# EAGLE design Desklamp_H180804_V1 (EAGLE 6.4)
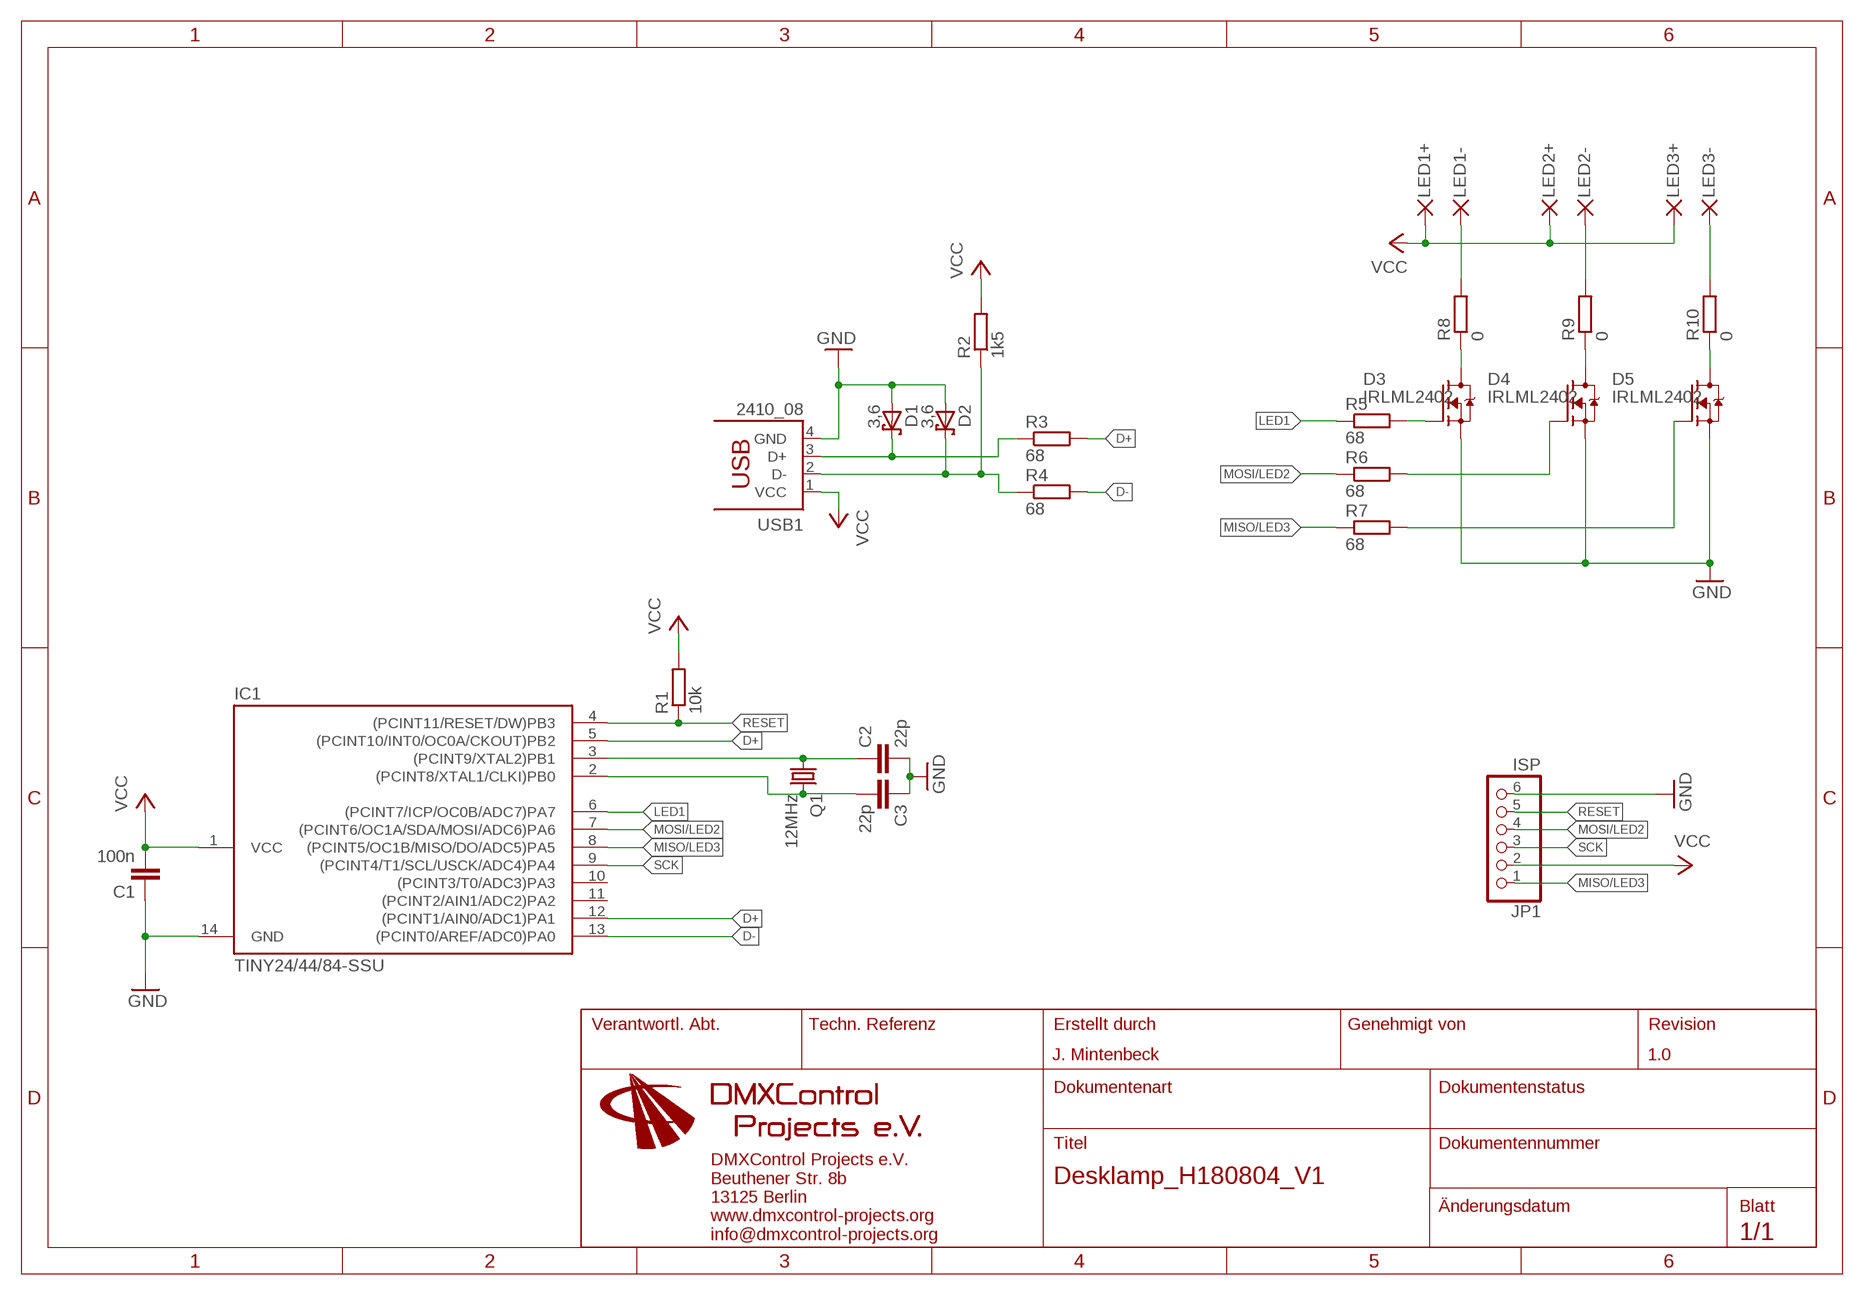
[diagram p0: schematic, sheet 1]

## Parts
C1  100n  C-EUC0805  [C0805]
C2  22p  C-EUC0805  [C0805]
C3  22p  C-EUC0805  [C0805]
D1  3,6  BAS40  [SOT23]
D2  3,6  BAS40  [SOT23]
D3  IRLML2402  [SOT23]
D4  IRLML2402  [SOT23]
D5  IRLML2402  [SOT23]
IC1  TINY24/44/84-SSU  [SOIC14]
JP1  ISP  PINHD-1X06_2.00  [1X06M]
PAD1  LED1+  SMD2  [SMD1,27-2,54]
PAD2  LED1-  SMD2  [SMD1,27-2,54]
PAD3  LED2+  SMD2  [SMD1,27-2,54]
PAD4  LED2-  SMD2  [SMD1,27-2,54]
PAD5  LED3+  SMD2  [SMD1,27-2,54]
PAD6  LED3-  SMD2  [SMD1,27-2,54]
Q1  12MHz  CRYSTALHC49UP  [HC49UP]
R1  10k  R-EU_R0805  [R0805]
R2  1k5  R-EU_R0805  [R0805]
R3  68  R-EU_R0805  [R0805]
R4  68  R-EU_R0805  [R0805]
R5  68  R-EU_R0805  [R0805]
R6  68  R-EU_R0805  [R0805]
R7  68  R-EU_R0805  [R0805]
R8  0  R-EU_R0805  [R0805]
R9  0  R-EU_R0805  [R0805]
R10  0  R-EU_R0805  [R0805]
USB1  2410_08  [2410_08]

## Nets
D+: IC1.5((PCINT10/INT0/OC0A/CKOUT)PB2) IC1.12((PCINT1/AIN0/ADC1)PA1) R3.2
D-: IC1.13((PCINT0/AREF/ADC0)PA0) R4.2
GND: C1.1 C2.2 C3.1 D1.1(A) D2.1(A) D3.2(S) D4.2(S) D5.2(S) IC1.14(GND) JP1.6 USB1.4(GND)
LED1: IC1.6((PCINT7/ICP/OC0B/ADC7)PA7) R5.1
MISO/LED3: IC1.8((PCINT5/OC1B/MISO/DO/ADC5)PA5) JP1.1 R7.1
MOSI/LED2: IC1.7((PCINT6/OC1A/SDA/MOSI/ADC6)PA6) JP1.4 R6.1
N$1: D3.3(D) R8.1
N$2: D4.3(D) R9.1
N$3: D4.1(G) R6.2
N$4: D5.3(D) R10.1
N$5: PAD2.1(P) R8.2
N$6: D1.3(C) R3.1 USB1.3(D+)
N$7: D2.3(C) R2.1 R4.1 USB1.2(D-)
N$8: C3.2 IC1.2((PCINT8/XTAL1/CLKI)PB0) Q1.2
N$10: C2.1 IC1.3((PCINT9/XTAL2)PB1) Q1.1
N$11: D3.1(G) R5.2
N$12: D5.1(G) R7.2
N$13: PAD4.1(P) R9.2
N$14: PAD6.1(P) R10.2
RESET: IC1.4((PCINT11/RESET/DW)PB3) JP1.5 R1.1
SCK: IC1.9((PCINT4/T1/SCL/USCK/ADC4)PA4) JP1.3
VCC: C1.2 IC1.1(VCC) JP1.2 PAD1.1(P) PAD3.1(P) PAD5.1(P) R1.2 R2.2 USB1.1(VCC)
Unconnected: IC1.10((PCINT3/T0/ADC3)PA3) IC1.11((PCINT2/AIN1/ADC2)PA2)

## Notes on the sheet
- J. Mintenbeck | 1.0

## Library data of the parts
C1 = rcl:C-EU: CAPACITOR, European symbol; PARTNO: CC0805KRX7R9BB104
C2 C3 = rcl:C-EU: CAPACITOR, European symbol; PARTNO: VVS-SMD COG 50 V 22 PF G0805
D1 D2 = diode:BAS40: Silicon Schottky Diodes General-purpose diode for high-speed switching; PARTNO: BZX84C3V6
D3-D5 = transistor-fet:IRLML2402; PARTNO: IRLML2402PBF
IC1 = avr-7:TINY24/44/84; PARTNO: ATTINY44ASSU
JP1 = pinhead-2:PINHD-1X06: PIN HEADER
PAD1-PAD6 = wirepad:SMD2: SMD PAD
Q1 = crystal:CRYSTAL: CRYSTAL; OC_FARNELL: unknown; OC_NEWARK: unknown; PARTNO: 12.000MHZ 49USMX/30/50/40/18PF/ATF
R1 = rcl:R-EU_: RESISTOR, European symbol; PARTNO: RC0805 FR-07 10 K
R2 = rcl:R-EU_: RESISTOR, European symbol; PARTNO: RC0805 FR-07 1,5 K
R3-R7 = rcl:R-EU_: RESISTOR, European symbol; PARTNO: RC0805 FR-07 68 R
R8-R10 = rcl:R-EU_: RESISTOR, European symbol; PARTNO: RC0805 FR-07 0 R
USB1 = con-lumberg:2410_08; PARTNO: 2410 08

## Board
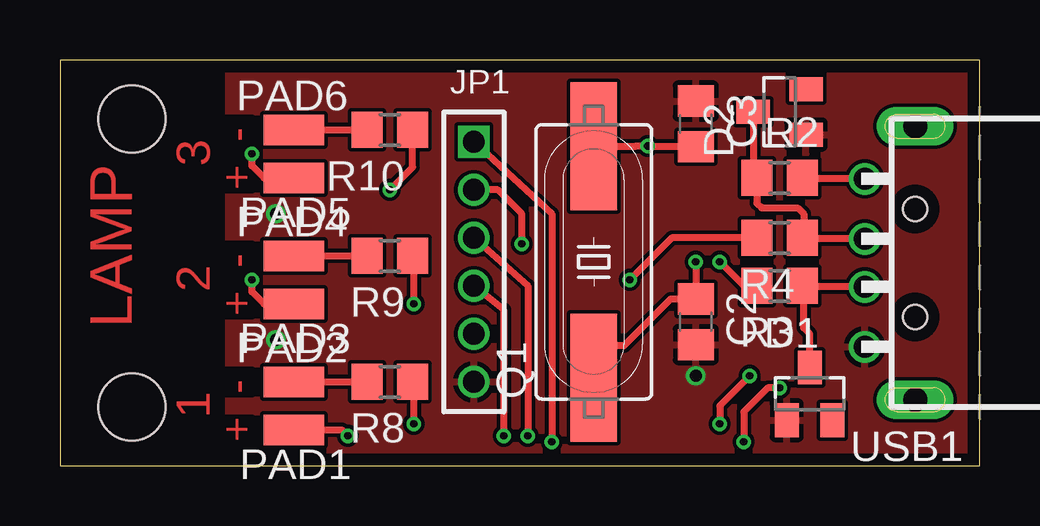
[diagram p1: board, top side]
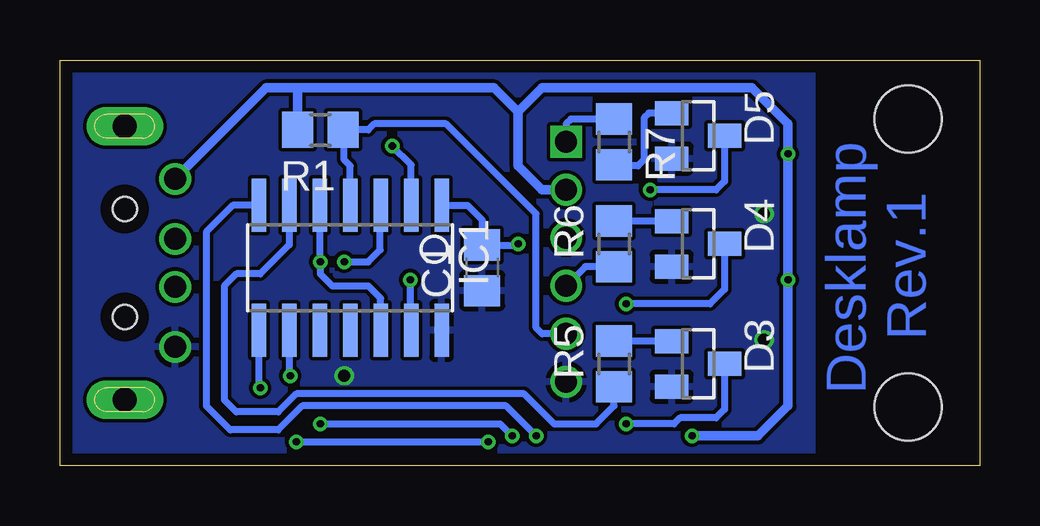
[diagram p2: board, bottom side, seen from below]

Size 38.35 x 16.91 mm. Coordinates in mm from the lower left corner, seen from the top.
Outline: 0,0 38.35,0 38.35,16.91 0,16.91 0,0
Copper layers (1*16): Top 0.035mm / dielectric 1.5mm / Bottom 0.035mm
Design rules "leiton": minimum track width 6mil, minimum drill 0.3mm, track to track 6mil, track to pad 6mil, pad to pad 6mil, via to via 6mil, smd to smd 6mil, copper to edge 20mil, drill to drill 8mil, minimum pad ring 8mil, minimum via ring 6mil, stop-mask expansion 3mil, vias tented up to drill 0mil, thermal gap 8mil
Holes 2.8 mm at 3,14.46 3,2.46

### Footprints (pad centres in the part's own frame; a part is rotated, then mirrored left to right if it is on the bottom)
C0805 = smd 1.3 x 1.5: 1 -0.95,0; 2 0.95,0
SOT23 = smd 1 x 1.4: 1 -0.95,-1.1; 2 0.95,-1.1; 3 0,1.1
SOIC14 = smd 0.61 x 2.21: 1 -3.81,-2.603; 2 -2.54,-2.603; 3 -1.27,-2.603; 4 0,-2.603; 5 1.27,-2.603; 6 2.54,-2.603; 7 3.81,-2.603; 8 3.81,2.603; 9 2.54,2.603; 10 1.27,2.603; 11 0,2.603; 12 -1.27,2.603; 13 -2.54,2.603; 14 -3.81,2.603
1X06M = drill 0.914 square: 1 -5,0 | drill 0.914: 2 -3,0; 3 -1,0; 4 1,0; 5 3,0; 6 5,0
SMD1,27-2,54 = smd 1.27 x 2.54: 1 0,0
HC49UP = smd 5.334 x 1.93: 1 -4.826,0; 2 4.826,0
R0805 = smd 1.3 x 1.5: 1 -0.95,0; 2 0.95,0
2410_08 = drill 0.92: 1 3.5,2.1; 2 1,2.1; 3 -1,2.1; 4 -3.5,2.1 | drill 1 pad 1.6 long: P$1 -5.7,0; P$2 5.7,0 | hole 1: -2.25,0; 2.25,0

### Placement (x,y rotation side)
C1  20.75,8.25 90 bottom
C2  26.5,6 270 top
C3  26.5,14.25 270 top
D1  31.25,3 0 top
D2  30,14.75 90 top
D3  11.75,4.25 270 bottom
D4  11.75,9.25 270 bottom
D5  11.75,13.75 270 bottom
IC1  26.25,8.25 180 bottom
JP1  17.25,8.5 270 top
PAD1  9.75,1.5 90 top
PAD2  9.75,3.5 270 top
PAD3  9.75,6.75 90 top
PAD4  9.75,8.75 270 top
PAD5  9.75,12 90 top
PAD6  9.75,14 270 top
Q1  22.25,8.5 90 top
R1  27.5,14 180 bottom
R2  30,12 0 top
R3  30,7.5 180 top
R4  30,9.5 180 top
R5  15.25,4.25 90 bottom
R6  15.25,9.25 90 bottom
R7  15.25,13.5 270 bottom
R8  13.75,3.5 180 top
R9  13.75,8.75 180 top
R10  13.75,14 180 top
USB1  35.65,8.46 90 top

### Tracks (layer width: path | path; a pad name or v marks a point on that pad's centre or on a via)
D+  (via drill 0.3)
  Top 0.3: R3.2 28.5,7.5 v27.5,8.5
  Bottom 0.3: IC1.5 27.5,10.83 v27.5,8.5 27.5,8 27,7.5 25.5,7.5 24.98,6.98 IC1.12
D-  (via drill 0.3)
  Top 0.3: R4.2 25.5,9.5 v23.75,7.75
  Bottom 0.3: v23.75,7.75 23.75,5.69 IC1.13
GND  (via drill 0.5)
  other vias: 26.5,3.75 9,10.5 9,5.25
  pour Bottom: 7,17 7,0 38.5,0 38.5,17
  pour Top: 7,17 7,0 38.5,0 38.5,17
LED1
  Bottom 0.3: IC1.6 28.79,9.21 30,8 31,8 31.5,7.5 31.5,2.75 31,2.25 29.25,2.25 28.5,3 19,3 17.75,1.75 16,1.75 15.25,2.5 R5.1
MISO/LED3  (via drill 0.3)
  Top 0.3: JP1.1 20.5,10.5 v20.5,1 | v30,3.25 29.5,3.25 28.5,2.25 v28.5,1
  Bottom 0.3: R7.1 17.05,14.45 17.25,14.25 JP1.1 | v28.5,1 v20.5,1 | IC1.8 30.06,3.31 v30,3.25
MOSI/LED2  (via drill 0.3)
  Top 0.3: v18.5,1.25 18.5,6.5 JP1.4
  Bottom 0.3: R6.1 16.45,8.3 JP1.4 | IC1.7 31.15,10.85 32.25,9.75 32.25,2.5 31.25,1.5 29.25,1.5 28.25,2.5 19.75,2.5 v18.5,1.25
N$1  (via drill 0.3)
  Top 0.3: v14.75,1.75 14.75,3.45 R8.1
  Bottom 0.3: D3.3 10.65,2.35 11,2 12.5,2 12.75,1.75 v14.75,1.75
N$2  (via drill 0.3)
  Top 0.3: v14.75,6.75 14.75,8.7 R9.1
  Bottom 0.3: D4.3 10.65,7.35 11.25,6.75 v14.75,6.75
N$3
  Bottom 0.3: D4.1 R6.2
N$4  (via drill 0.3)
  Top 0.3: v13.75,11.5 14.7,12.45 R10.1
  Bottom 0.3: D5.3 10.65,11.85 11,11.5 v13.75,11.5
N$5
  Top 0.3: PAD2.1 R8.2
N$6
  Top 0.3: USB1.3 31,7.46 R3.1 31,7.45 31,5.75 31.25,5.5 D1.3
N$7
  Top 0.3: USB1.2 31,9.46 R4.1 31,9.55 31,10.5 30.75,10.75 29.25,10.75 29.05,10.95 R2.1 28.9,12.4 D2.3
N$8  (via drill 0.3)
  Top 0.3: Q1.2 24,13.33 v24.5,13.33 26.47,13.33 C3.2
  Bottom 0.3: IC1.2 23.71,12.54 v24.5,13.33
N$10  (via drill 0.3)
  Top 0.3: 22.25,5.25 22.25,5 | 22.25,5 Q1.1 | v26.5,8.5 C2.1 25.45,6.95 23.5,5 22.25,5
  Bottom 0.3: v26.5,8.5 25.5,8.5 25,9 25,10.83 IC1.3
N$11
  Bottom 0.3: D3.1 R5.2
N$12
  Bottom 0.3: D5.1 13.8,14.7 14,14.5 14,12.75 14.25,12.5 15.2,12.5 R7.2
N$13
  Top 0.3: PAD4.1 R9.2
N$14
  Top 0.3: PAD6.1 R10.2
RESET
  Bottom 0.3: IC1.4 26.25,12.5 26.5,12.75 26.5,13.95 R1.1 25.5,14 25.25,14.25 22.25,14.25 18.5,10.5 18.5,5.75 18.25,5.5 JP1.5
SCK  (via drill 0.3)
  Top 0.3: JP1.3 19.5,7.5 v19.5,1.25 | v28.75,3.75 27.5,2.5 v27.5,1.75
  Bottom 0.3: IC1.9 28.79,3.79 v28.75,3.75 | v27.5,1.75 20,1.75 v19.5,1.25
VCC  (via drill 0.3)
  Top 0.3: USB1.1 31,11.96 R2.2 | PAD1.1 11.75,1.5 v12,1.25 | PAD3.1 8.5,6.75 8,7.25 v8,7.75 | PAD5.1 8.5,12 8,12.5 v8,13 | v19.25,9.25 19.25,10.5 18.25,11.5 JP1.2
  Bottom 0.3: 28.45,15.7 28.5,15.75 | IC1.1 21.35,10.85 20.75,10.25 C1.2 19.3,9.2 v19.25,9.25
  Bottom 0.4: v12,1.25 9.25,1.25 8,2.5 v8,7.75 v8,13 8,14.25 9.5,15.75 18.25,15.75 19.25,14.75 | JP1.2 18.25,11.5 19.25,12.5 19.25,14.75 | 19.25,14.75 20.25,15.75 28.5,15.75 29.75,15.75 USB1.1 | R1.2 28.45,15.7

### Text on the board
Top: - | 3 | + | - | 2 | LAMP | + | - | 1 | +
Bottom: Rev.1 | Desklamp